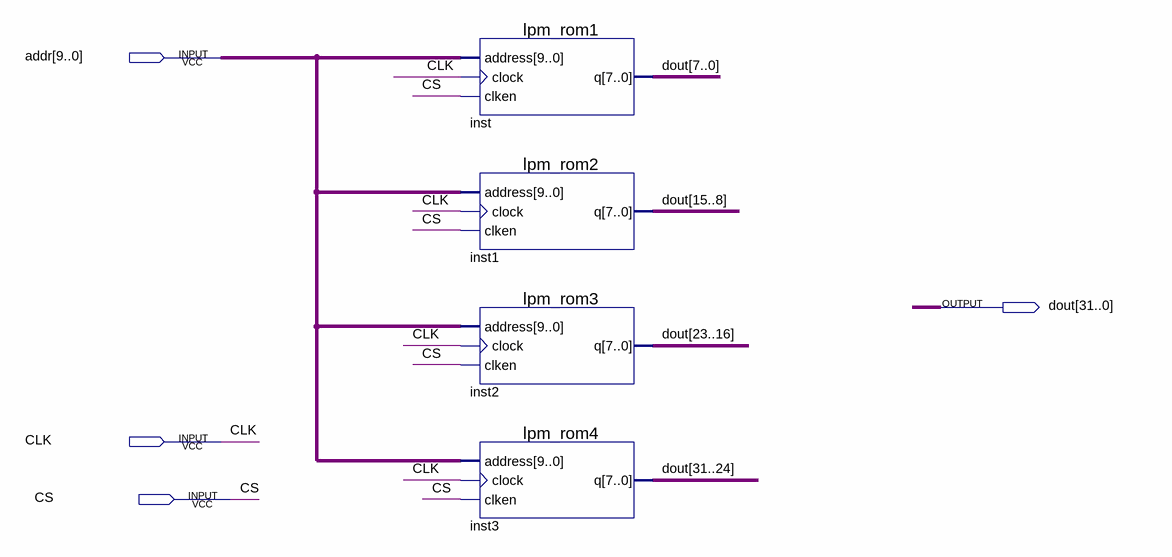
[diagram p0: schematic sheet]
// Quartus schematic IMEM.bdf as structural Verilog: 4 symbols, 4 pins
module IMEM (
  input  [9:0] addr,
  input  CLK,
  input  CS,
  output [31:0] dout
);

  lpm_rom1 inst (.address(addr), .clock(CLK), .clken(CS), .q(dout[7:0]));
  lpm_rom2 inst1 (.address(addr), .clock(CLK), .clken(CS), .q(dout[15:8]));
  lpm_rom3 inst2 (.address(addr), .clock(CLK), .clken(CS), .q(dout[23:16]));
  lpm_rom4 inst3 (.address(addr), .clock(CLK), .clken(CS), .q(dout[31:24]));
endmodule
